# Altium project PCB_Project.PrjPcb
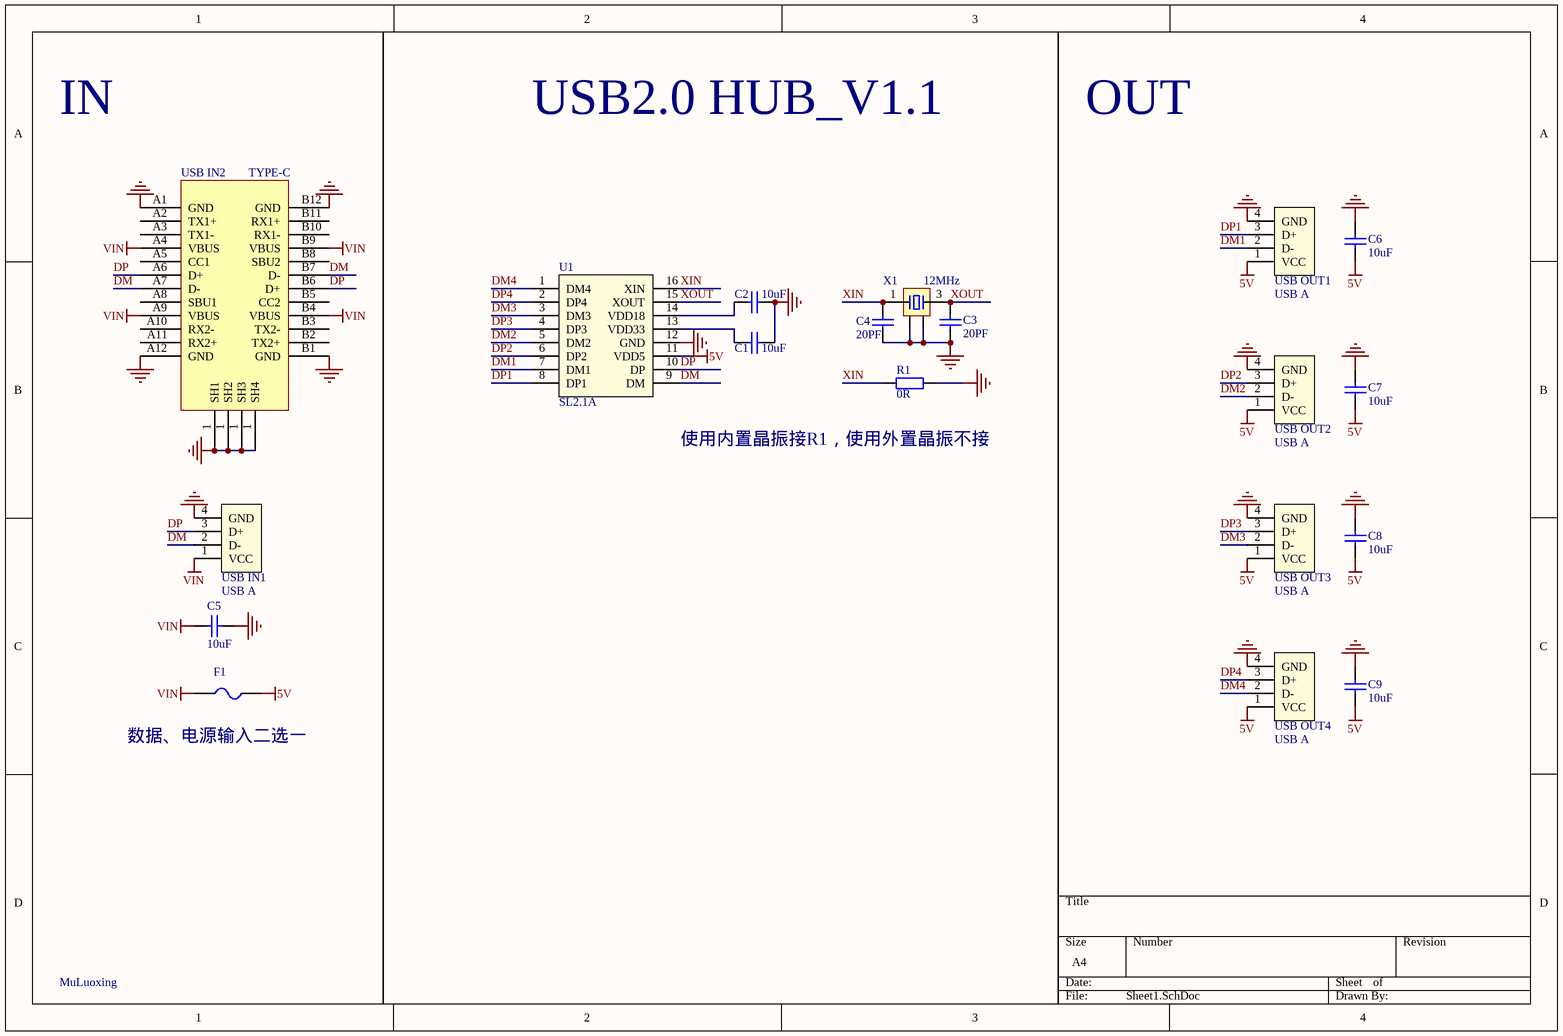
[diagram p0: Sheet1.SchDoc]
1 sheet, 19 parts. Net scope: global (net labels, ports and power ports of the same name join across sheets).
Board file: PCB1.PcbDoc

## Sheet Sheet1.SchDoc
size A4

### Parts
C1  10uF  [C 0805]
C2  10uF  [C 0805]
C3  20PF  [C 0805]
C4  20PF  [C 0805]
C5  10uF  [C 0805]
C6  10uF  [C 0805]
C7  10uF  [C 0805]
C8  10uF  [C 0805]
C9  10uF  [C 0805]
F1  MSMD200-8V 2A  [FU 1206]  (value not drawn)
R1  0R  [R 0805]
U1  SL2.1A  [SOP16_N]
USB_IN1  USB A  [USB-A/S_A]
USB_IN2  TYPE-C  [USB Type-C-16Pin_A]
USB_OUT1  USB A  [USB-A/S_A]
USB_OUT2  USB A  [USB-A/S_A]
USB_OUT3  USB A  [USB-A/S_A]
USB_OUT4  USB A  [USB-A/S_A]
X1  12MHz  [OSC]

### Nets
5V: C6.1 C7.1 C8.1 C9.1 F1.2 U1.11(VDD5) USB_OUT1.1(VCC) USB_OUT2.1(VCC) USB_OUT3.1(VCC) USB_OUT4.1(VCC)
GND: C1.1 C2.1 C3.1 C4.1 C5.2 C6.2 C7.2 C8.2 C9.2 R1.1 U1.12(GND) USB_IN1.4(GND) USB_IN2.1(SH4) USB_IN2.A1(GND) USB_IN2.A12(GND) USB_IN2.B1(GND) USB_IN2.B12(GND) USB_OUT1.4(GND) USB_OUT2.4(GND) USB_OUT3.4(GND) USB_OUT4.4(GND) X1.2 X1.4
VIN: C5.1 F1.1 USB_IN1.1(VCC) USB_IN2.A4(VBUS) USB_IN2.A9(VBUS) USB_IN2.B4(VBUS) USB_IN2.B9(VBUS)
DM: U1.9(DM) USB_IN1.2(D-) USB_IN2.A7(D-) USB_IN2.B7(D-)
DM1: U1.7(DM1) USB_OUT1.2(D-)
DM2: U1.5(DM2) USB_OUT2.2(D-)
DM3: U1.3(DM3) USB_OUT3.2(D-)
DM4: U1.1(DM4) USB_OUT4.2(D-)
DP: U1.10(DP) USB_IN1.3(D+) USB_IN2.A6(D+) USB_IN2.B6(D+)
DP1: U1.8(DP1) USB_OUT1.3(D+)
DP2: U1.6(DP2) USB_OUT2.3(D+)
DP3: U1.4(DP3) USB_OUT3.3(D+)
DP4: U1.2(DP4) USB_OUT4.3(D+)
XIN: C4.2 R1.2 U1.16(XIN) X1.1
XOUT: C3.2 U1.15(XOUT) X1.3
NetC1_2: C1.2 U1.13(VDD33)
NetC2_2: C2.2 U1.14(VDD18)

Not connected (* = marked no-connect by the designer): USB_IN2 A2(TX1+) A3(TX1-) A5(CC1) A8(SBU1) A10(RX2-) A11(RX2+) B2(TX2+) B3(TX2-) B5(CC2) B8(SBU2) B10(RX1-) B11(RX1+)

### Notes on the sheet
- IN
- USB2.0 HUB_V1.1
- OUT
- 使用内置晶振接R1，使用外置晶振不接
- (near F1) 数据、电源输入二选一
- MuLuoxing

### Library data of the parts
C1-C9 = Cap1
F1 = FU: 贴片保险丝; BOM名称: 贴片保险丝
R1 = Res
USB_IN2 = TYPE-C 16PIN
X1 = XTAL-4P: 4脚无源晶振; 负载电容: CL20pF; BOM名称: 4脚无源晶振